# EAGLE design opt2bnc_trigger_1Ch (EAGLE 9.3.0)
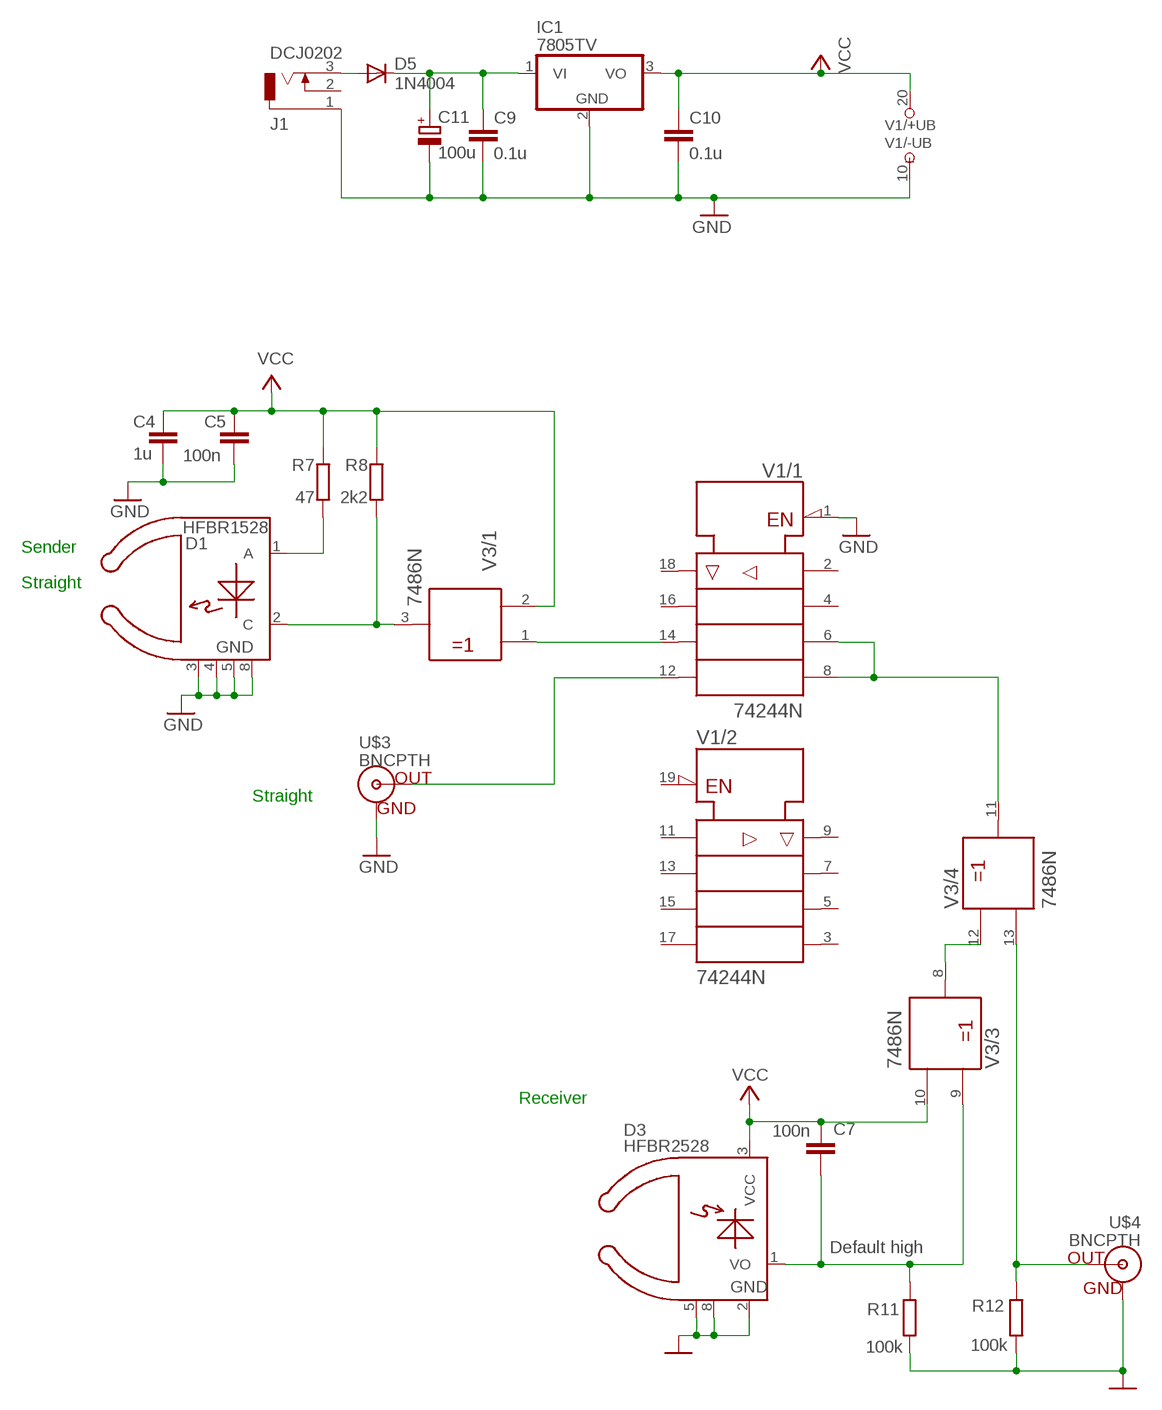
[diagram p0: schematic, sheet 1]

## Parts
C4  1u  C-EU025-025X050  [C025-025X050]
C5  100n  C-EU025-025X050  [C025-025X050]
C7  100n  C-EU025-025X050  [C025-025X050]
C9  0.1u  C-EU025-024X044  [C025-024X044]
C10  0.1u  C-EU025-024X044  [C025-024X044]
C11  100u  CPOL-EUE2-4  [E2-4]
D1  HFBR1528  [HFBR25XX]
D3  HFBR2528  [HFBR25XX]
D5  1N4004  [DO41-10]
IC1  7805TV  [TO220V]
J1  DCJ0202  [DCJ0202]
R7  47  R-EU_0207/7  [0207/7]
R8  2k2  R-EU_0207/7  [0207/7]
R11  100k  R-EU_0207/7  [0207/7]
R12  100k  R-EU_0207/7  [0207/7]
U$3  BNCPTH  [BNC]
U$4  BNCPTH  [BNC]
V1  74244N  [DIL20]
V3  7486N  [DIL14]

## Nets
GND: C4.2 C5.2 C9.2 C10.2 C11.- D1.3 D1.4 D1.5(GND) D1.8(GND) D3.2(GND) D3.5 D3.8 IC1.2(GND) J1.1 R11.2 R12.2 U$3.GND U$4.GND V1.1(/1:!G) V1.10(/-UB:-UB)
N$1: C9.1 C11.+ D5.C IC1.1(VI)
N$2: V1.6(/1:A3) V1.8(/1:A4) V3.11(/4:Y)
N$9: C7.1 D3.1(VO) R11.1 V3.9(/3:A)
N$11: D5.A J1.3
N$14: D1.1(A) R7.1
N$15: U$3.S(OUT) V1.12(/1:Y4)
N$21: D1.2(C) R8.1 V3.3(/1:Y)
N$26: R12.1 U$4.S(OUT) V3.13(/4:B)
N$27: V3.8(/3:Y) V3.12(/4:A)
N$31: V1.14(/1:Y3) V3.1(/1:A)
VCC: C4.1 C5.1 C7.2 C10.1 D3.3(VCC) IC1.3(VO) R7.2 R8.2 V1.20(/+UB:+UB) V3.2(/1:B) V3.10(/3:B)
Unconnected: J1.2 V1.2(/1:A1) V1.3(/2:Y4) V1.4(/1:A2) V1.5(/2:Y3) V1.7(/2:Y2) V1.9(/2:Y1) V1.11(/2:A1) V1.13(/2:A2) V1.15(/2:A3) V1.16(/1:Y2) V1.17(/2:A4) V1.18(/1:Y1) V1.19(/2:!G) V3.4(/2:A) V3.5(/2:B) V3.6(/2:Y)

## Notes on the sheet
- Sender
- Straight
- Straight
- Receiver
- Default high

## Power pins joined to a net without a drawn wire
+UB: V3.14(/+UB:+UB)
-UB: V3.7(/-UB:-UB)

## Library data of the parts
C4 C5 C7 C9 C10 = rcl:C-EU: CAPACITOR, European symbol
C11 = rcl:CPOL-EU: POLARIZED CAPACITOR, European symbol
D1 = opto-transmittter-hp:HFBR1528: OPTO TRANSMITTER; MF: AGILENT TECHNOLOGIES; MPN: HFBR-1528; OC_FARNELL: 1247638; OC_NEWARK: 06F6056
D3 = opto-transmittter-hp:HFBR2528: OPTO RECEIVER; MF: AGILENT TECHNOLOGIES; MPN: HFBR-2528; OC_FARNELL: 1247664; OC_NEWARK: 06F6096
D5 = adafruit:1N4004: DIODE General purpose 1N400x type rectifier (With bigger pads) http://www.ladyada.net/library/pcb/eaglelibrary.html
IC1 = linear:78*: Positive VOLTAGE REGULATOR Source: http://cache.national.com/ds/LM/LM78L05.pdf http://www.fairchildsemi.com/ds/LM/LM7805.pdf
J1 = con-jack:DCJ0202: DC POWER JACK Source: DCJ0202.pdf; OC_FARNELL: unknown; OC_NEWARK: unknown
R7 R8 R11 R12 = rcl:R-EU_: RESISTOR, European symbol
U$3 U$4 = tglib2:BNC: BNC Connector, Mouser Part# 5227161
V1 = 74ttl-din:74*244: Octal BUFFER and LINE DRIVER, 3-state
V3 = 74ttl-din:74*86: Quad 2-input EXCLUSIV-OR gate

## Board
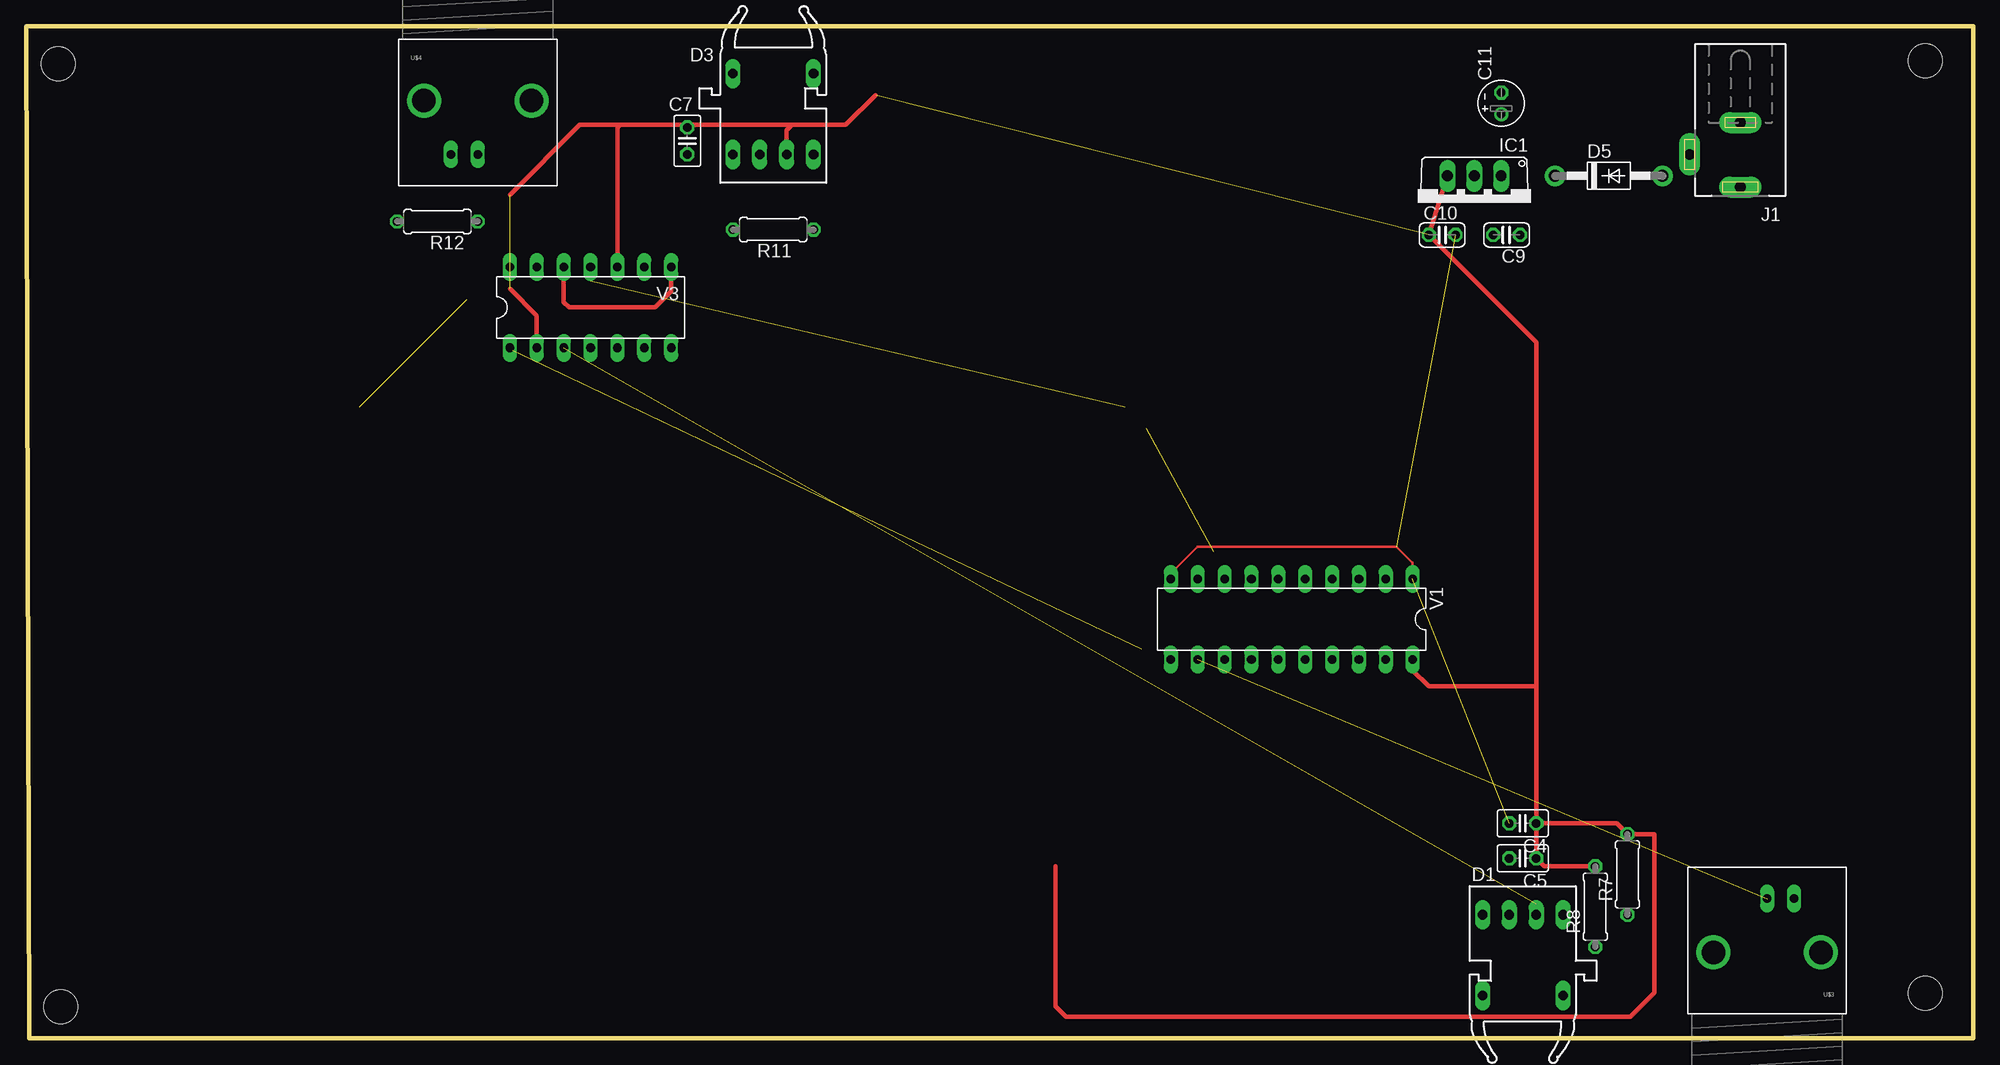
[diagram p1: board, top side]
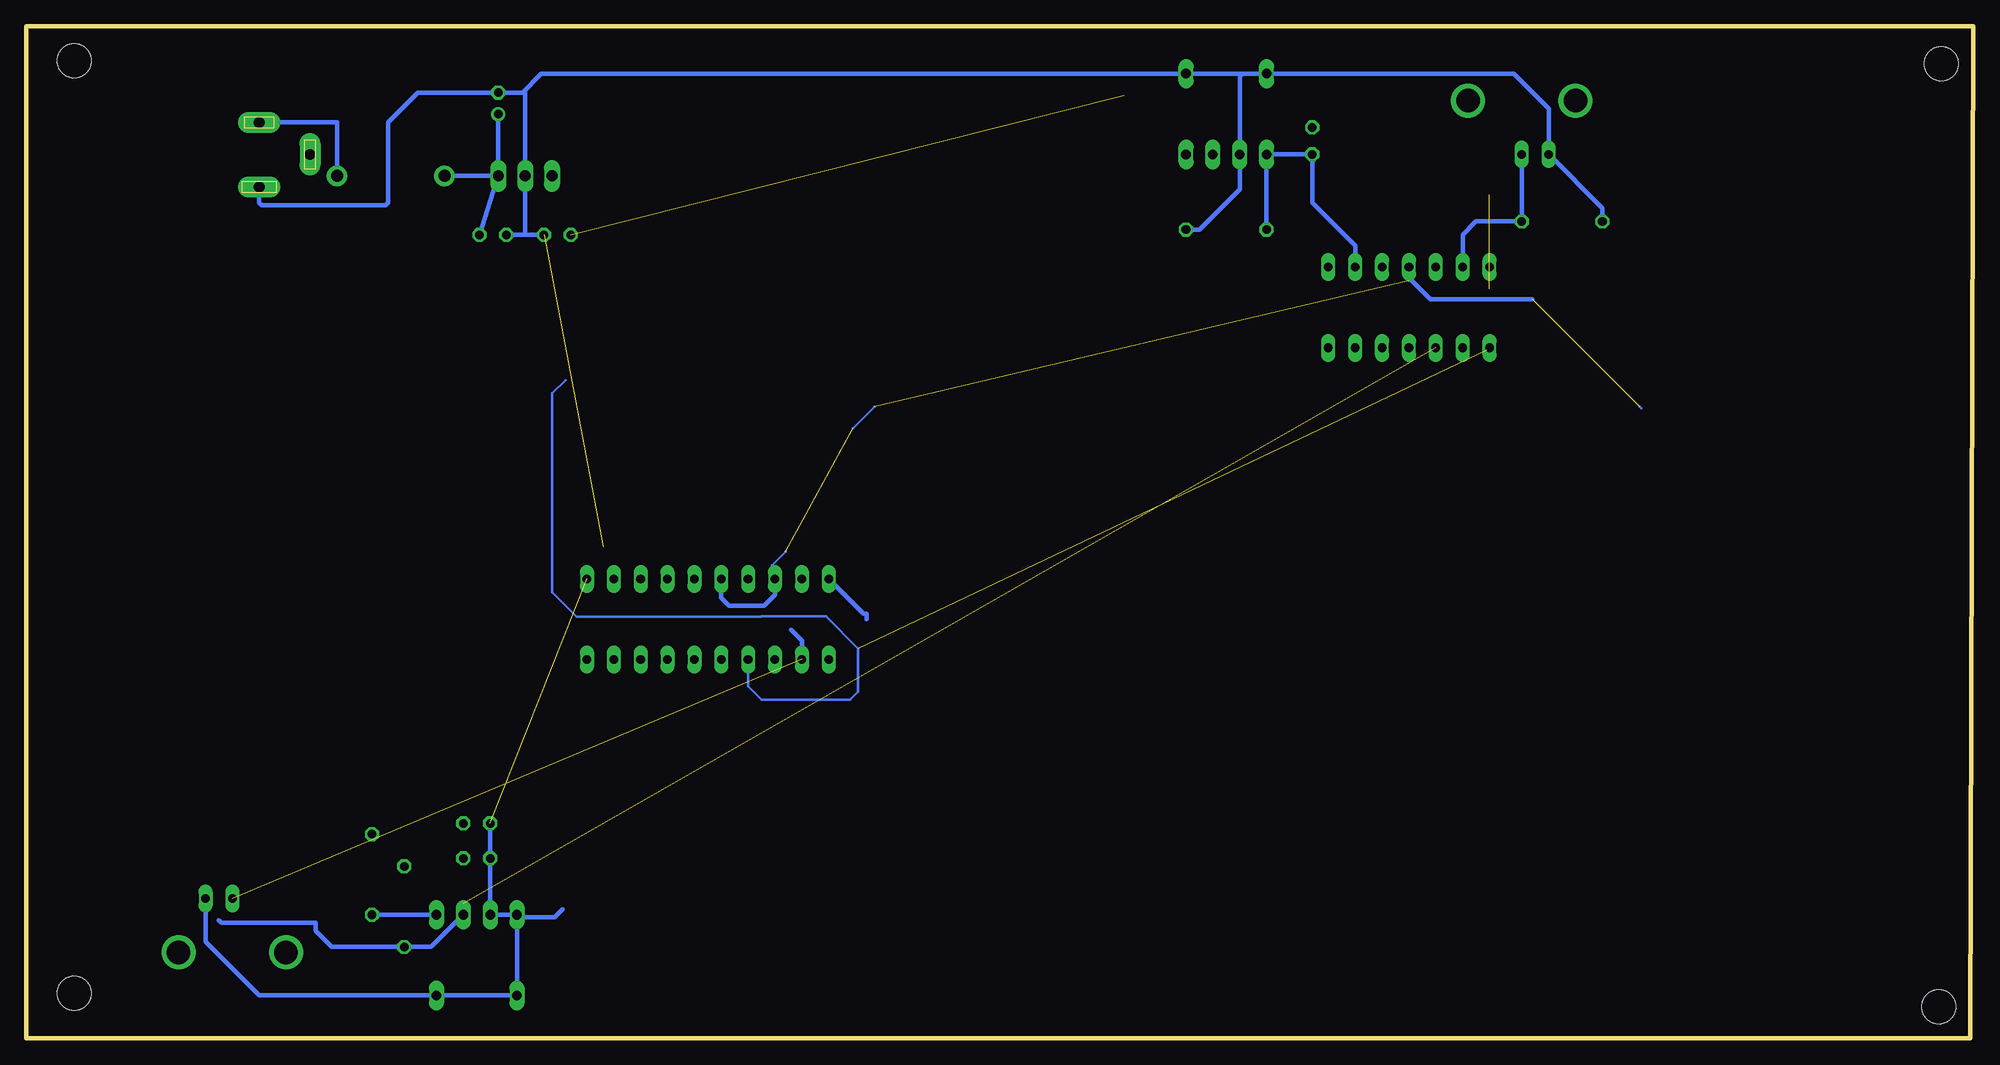
[diagram p2: board, bottom side, seen from below]

Size 184.06 x 95.65 mm. Coordinates in mm from the lower left corner, seen from the top.
Outline: 184.06,0 0.25,0 0,95.65 184.06,95.65 184.06,0
Copper layers (1*16): Top 0.035mm / dielectric 1.5mm / Bottom 0.035mm
Design rules "default": minimum track width 10mil, minimum drill 24mil, track to track 8mil, track to pad 8mil, pad to pad 8mil, via to via 8mil, smd to smd 8mil, copper to edge 40mil, drill to drill 8mil, minimum pad ring 10mil, minimum via ring 8mil, stop-mask expansion 4mil, vias tented up to drill 0mil, thermal gap 10mil
Holes 3.2 mm at 179.53,4.27 179.53,92.4 3.25,3 3,92.15

### Footprints (pad centres in the part's own frame; a part is rotated, then mirrored left to right if it is on the bottom)
C025-025X050 = drill 0.813 octagon: 1 -1.27,0; 2 1.27,0
C025-024X044 = drill 0.813 octagon: 1 -1.27,0; 2 1.27,0
E2-4 = drill 0.813 pad 1.27: + -1.016,0 | drill 0.813 pad 1.27 octagon: - 1.016,0
HFBR25XX = drill 0.9 long: 1 0,3.81; 2 0,1.27; 3 0,-1.27; 4 0,-3.81; 5 7.62,-3.81; 8 7.62,3.81
DO41-10 = drill 1.118 pad 1.93: A 5.08,0; C -5.08,0
TO220V = drill 1.016 long: 1 -2.54,-2.54; 2 0,-2.54; 3 2.54,-2.54
DCJ0202 = drill 1 pad 2 long: 1 0,3.1; 2 4.8,0; 3 0,-3
0207/7 = drill 0.813 octagon: 1 -3.81,0; 2 3.81,0
BNC = drill 2.2: 3 -5.08,5.08; 4 5.08,5.08 | drill 0.8 long: GND -2.54,0; S 0,0
DIL20 = drill 0.813 long: 1 -11.43,-3.81; 2 -8.89,-3.81; 3 -6.35,-3.81; 4 -3.81,-3.81; 5 -1.27,-3.81; 6 1.27,-3.81; 7 3.81,-3.81; 8 6.35,-3.81; 9 8.89,-3.81; 10 11.43,-3.81; 11 11.43,3.81; 12 8.89,3.81; 13 6.35,3.81; 14 3.81,3.81; 15 1.27,3.81; 16 -1.27,3.81; 17 -3.81,3.81; 18 -6.35,3.81; 19 -8.89,3.81; 20 -11.43,3.81
DIL14 = drill 0.813 long: 1 -7.62,-3.81; 2 -5.08,-3.81; 3 -2.54,-3.81; 4 0,-3.81; 5 2.54,-3.81; 6 5.08,-3.81; 7 7.62,-3.81; 8 7.62,3.81; 9 5.08,3.81; 10 2.54,3.81; 11 0,3.81; 12 -2.54,3.81; 13 -5.08,3.81; 14 -7.62,3.81

### Placement (x,y rotation side)
C4  141.48,20.32 180 top
C5  141.48,17.02 180 top
C7  62.48,84.84 90 top
C9  139.95,75.95 180 top
C10  133.86,75.95 0 top
C11  139.45,88.39 90 top
D1  141.48,11.68 270 top
D3  70.61,83.57 90 top
D5  149.61,81.53 0 top
IC1  136.91,78.99 180 top
J1  162.05,83.57 180 top
R7  151.38,15.49 90 top
R8  148.34,12.45 90 top
R11  70.61,76.45 0 top
R12  38.86,77.22 180 top
U$3  164.59,13.21 180 top
U$4  42.67,83.57 0 top
V1  119.63,39.62 180 top
V3  53.34,69.09 0 top

### Tracks (layer width: path | path; a pad name or v marks a point on that pad's centre or on a via)
GND  (2 unrouted)
  Top 0.254: V1.10 108.2,43.94 110.74,46.48 129.54,46.48 131.06,44.96 V1.1
  Bottom 0.406: 137.16,89.41 136.91,89.41 IC1.2 136.91,75.95 | 137.16,89.41 C11.- 147.07,89.41 149.86,86.61 149.86,78.99 150.11,78.74 161.8,78.74 162.05,78.99 J1.1 | C10.2 136.91,75.95 | 136.91,75.95 C9.2 | R11.2 73.15,76.45 69.34,80.26 D3.2 69.34,90.93 69.09,91.19 | 69.09,91.19 D3.8 43.43,91.19 40.13,87.88 U$4.GND 35.05,78.49 R12.2 | 69.09,91.19 D3.5 135.38,91.19 137.16,89.41 | 137.67,11.43 D1.4 D1.3 C5.2 C4.2 | 137.67,11.43 D1.5 D1.8 162.05,4.06 167.13,9.14 U$3.GND | 137.67,11.43 134.11,11.43 133.35,12.19 | V1.10 104.9,40.13 104.65,40.13 104.65,39.62
N$1
  Bottom 0.406: IC1.1 D5.C | C11.+ IC1.1 | IC1.1 C9.1
N$2  (3 unrouted)
  Bottom 0.254: V3.11 53.34,71.63 | 112.27,45.97 113.54,44.7 113.54,43.69 V1.8 | 31.5,59.69 31.37,59.56 | 105.92,57.66 103.89,59.69
  Bottom 0.406: V3.11 53.34,71.88 51.31,69.85 41.66,69.85 | V1.6 118.36,41.66 117.6,40.89 114.3,40.89 113.28,41.91 V1.8
N$9
  Bottom 0.406: R11.1 D3.1 C7.1 62.48,78.99 58.42,74.93 V3.9
N$11
  Bottom 0.406: D5.A 154.69,86.61 162,86.61 J1.3
N$14
  Bottom 0.406: D1.1 R7.1
N$15  (1 unrouted)
  Bottom 0.406: 111.76,38.61 110.74,37.59 V1.12
N$21  (1 unrouted)
  Bottom 0.406: 142.75,12.7 D1.2 145.8,8.64 R8.1 155.19,8.64 156.72,10.16 156.72,10.92 165.61,10.92 165.86,11.18
N$26
  Bottom 0.406: U$4.S R12.1 46.99,77.22 48.26,75.95 V3.13
N$27
  Top 0.406: V3.12 50.8,69.6 51.31,69.09 59.44,69.09 60.96,70.61 V3.8
N$31  (1 unrouted)
  Bottom 0.254: V3.1 45.97,65.02 | 133.1,62.23 134.37,60.96 134.37,42.16 132.05,39.85 114.59,39.85 114.56,39.88 108.46,39.88 105.41,36.83 105.41,32.77 106.17,32 114.55,32 115.82,33.27 V1.14
VCC  (2 unrouted)
  Top 0.406: IC1.3 C10.1 142.75,65.79 142.75,33.27 | IC1.3 134.11,81.79 | 72.39,86.36 71.88,85.85 D3.3 | 80.26,89.15 77.47,86.36 72.39,86.36 | 45.72,79.76 52.32,86.36 56.13,86.36 | 134.37,82.3 IC1.3 | 56.13,86.36 62.23,86.36 C7.2 62.74,86.36 72.39,86.36 | 97.28,16.26 97.28,3.05 98.3,2.03 151.64,2.03 153.92,4.32 153.92,19.3 R7.2 150.37,20.32 C4.1 | C4.1 C5.1 143.51,16.26 R8.2 | 142.75,33.27 C4.1 | V1.20 131.06,34.8 132.59,33.27 142.75,33.27 | V3.10 55.88,86.11 56.13,86.36 | V3.2 48.26,68.33 45.72,70.87